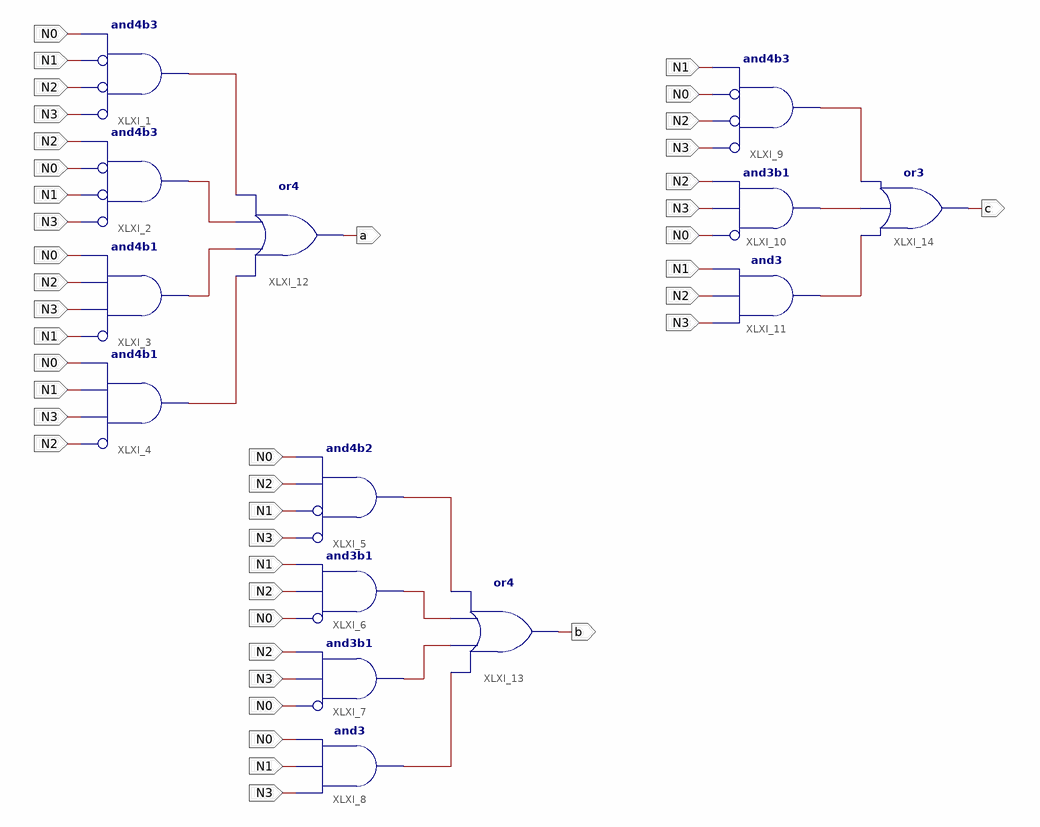
[diagram p0: schematic sheet 1]
// Xilinx ISE schematic combilogic.sch (spartan3e) as structural Verilog: 14 symbols, 7 ports
module combilogic (
  input  N0,
  input  N1,
  input  N2,
  input  N3,
  output b,
  output c,
  output a
);

  wire XLXN_2, XLXN_3, XLXN_4, XLXN_5, XLXN_6, XLXN_7, XLXN_8, XLXN_9, XLXN_10, XLXN_11, XLXN_12;

  and XLXI_5 (XLXN_6, ~N3, ~N1, N2, N0);  // and4b2
  and XLXI_6 (XLXN_7, ~N0, N2, N1);  // and3b1
  and XLXI_7 (XLXN_8, ~N0, N3, N2);  // and3b1
  and XLXI_8 (XLXN_9, N3, N1, N0);
  and XLXI_9 (XLXN_10, ~N3, ~N2, ~N0, N1);  // and4b3
  and XLXI_10 (XLXN_11, ~N0, N3, N2);  // and3b1
  and XLXI_11 (XLXN_12, N3, N2, N1);
  or XLXI_13 (b, XLXN_9, XLXN_8, XLXN_7, XLXN_6);
  or XLXI_14 (c, XLXN_12, XLXN_11, XLXN_10);
  and XLXI_1 (XLXN_2, ~N3, ~N2, ~N1, N0);  // and4b3
  and XLXI_2 (XLXN_3, ~N3, ~N1, ~N0, N2);  // and4b3
  and XLXI_3 (XLXN_4, ~N1, N3, N2, N0);  // and4b1
  and XLXI_4 (XLXN_5, ~N2, N3, N1, N0);  // and4b1
  or XLXI_12 (a, XLXN_5, XLXN_4, XLXN_3, XLXN_2);
endmodule
